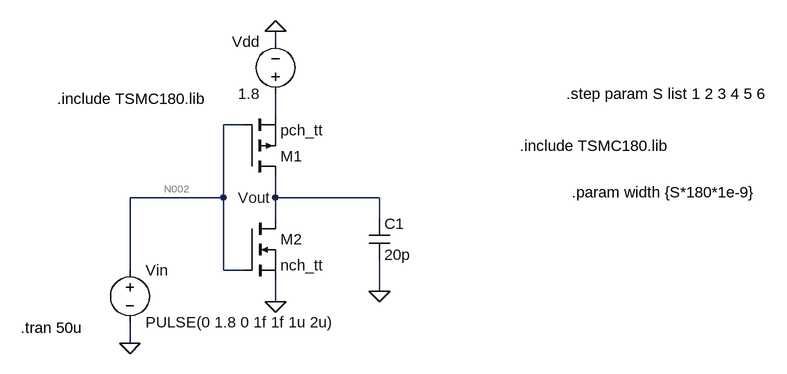
[diagram p0: schematic q2 (2).asc]
q2 (2).asc, the LTspice schematic file:
Version 4
SHEET 1 1012 680
WIRE 224 -176 224 -192
WIRE 224 -64 224 -96
WIRE 176 -48 144 -48
WIRE 144 64 144 -48
WIRE 144 64 0 64
WIRE 224 64 224 32
WIRE 384 64 224 64
WIRE 224 96 224 64
WIRE 384 96 384 64
WIRE 0 176 0 64
WIRE 144 176 144 64
WIRE 176 176 144 176
WIRE 384 208 384 160
WIRE 224 224 224 192
WIRE 0 288 0 256
FLAG 224 224 0
FLAG 224 -192 0
FLAG 0 288 0
FLAG 224 64 Vout
FLAG 384 208 0
SYMBOL pmos 176 32 M180
SYMATTR InstName M1
SYMATTR Value pch_tt
SYMATTR Value2 w={5.27*width} l=180n
SYMBOL nmos 176 96 R0
SYMATTR InstName M2
SYMATTR Value nch_tt
SYMATTR Value2 w={width} l=180n
SYMBOL voltage 224 -80 R180
WINDOW 0 24 96 Left 2
WINDOW 3 24 16 Left 2
WINDOW 123 0 0 Left 0
WINDOW 39 0 0 Left 0
SYMATTR InstName Vdd
SYMATTR Value 1.8
SYMBOL voltage 0 160 R0
WINDOW 123 0 0 Left 0
WINDOW 39 0 0 Left 0
SYMATTR InstName Vin
SYMATTR Value PULSE(0 1.8 0 1f 1f 1u 2u)
SYMBOL cap 368 96 R0
SYMATTR InstName C1
SYMATTR Value 20p
TEXT -112 -88 Left 2 !.include TSMC180.lib
TEXT -168 264 Left 2 !.tran 50u
TEXT 600 -16 Left 2 !.include TSMC180.lib
TEXT 680 56 Left 2 !.param width {S*180*1e-9}
TEXT 672 -96 Left 2 !.step param S list 1 2 3 4 5 6

The netlist it stands for:
* q2 (2).asc
M1 Vout N002 N001 N001 pch_tt w={5.27*width} l=180n
M2 Vout N002 0 0 nch_tt w={width} l=180n
Vdd N001 0 1.8
Vin N002 0 PULSE(0 1.8 0 1f 1f 1u 2u)
C1 Vout 0 20p
.model NMOS NMOS
.model PMOS PMOS
.lib standard.mos
.include TSMC180.lib
.tran 50u
.include TSMC180.lib
.param width {S*180*1e-9}
.step param S list 1 2 3 4 5 6
.backanno
.end

* Results of the author's LTspice run, read from the files saved beside the schematic
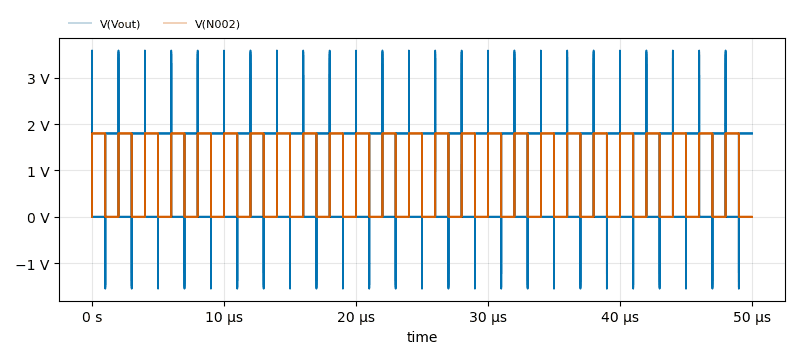
[diagram p1: Transient Analysis of q2 (2).asc, plotted from the saved traces]
* Transient Analysis, 6 runs:
*   V(Vout) [s=1]: min -1.222 V, max 3.062 V, average 900 mV, rms 1.273 V, last 1.8 V
*   V(Vout) [s=2]: min -1.393 V, max 3.31 V, average 900 mV, rms 1.273 V, last 1.8 V
*   V(Vout) [s=3]: min -1.469 V, max 3.436 V, average 900 mV, rms 1.273 V, last 1.8 V
*   V(Vout) [s=4]: min -1.511 V, max 3.511 V, average 900 mV, rms 1.273 V, last 1.8 V
*   V(Vout) [s=5]: min -1.538 V, max 3.56 V, average 900 mV, rms 1.273 V, last 1.8 V
*   V(Vout) [s=6]: min -1.556 V, max 3.595 V, average 900 mV, rms 1.273 V, last 1.8 V
*   V(N002) [s=1]: min 0 V, max 1.8 V, average 900 mV, rms 1.273 V, last 12.2 µV
*   V(N002) [s=2]: min 0 V, max 1.8 V, average 900 mV, rms 1.273 V, last 12.2 µV
*   V(N002) [s=3]: min 0 V, max 1.8 V, average 900 mV, rms 1.273 V, last 12.2 µV
*   V(N002) [s=4]: min 0 V, max 1.8 V, average 900 mV, rms 1.273 V, last 12.2 µV
*   V(N002) [s=5]: min 0 V, max 1.8 V, average 900 mV, rms 1.273 V, last 12.2 µV
*   V(N002) [s=6]: min 0 V, max 1.8 V, average 900 mV, rms 1.273 V, last 12.2 µV